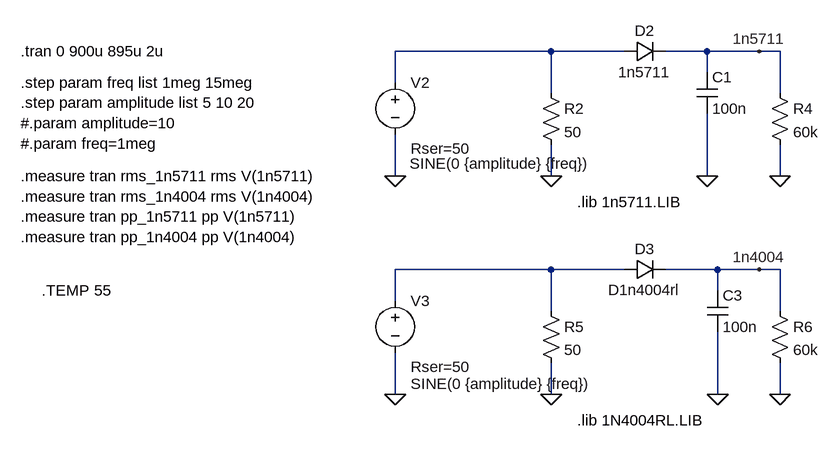
[diagram p0: schematic diode-capacitor-peak-detector.asc]
diode-capacitor-peak-detector.asc, the LTspice schematic file:
Version 4
SHEET 1 1252 992
WIRE 624 288 384 288
WIRE 736 288 624 288
WIRE 864 288 800 288
WIRE 944 288 864 288
WIRE 976 288 944 288
WIRE 864 320 864 288
WIRE 384 336 384 288
WIRE 624 352 624 288
WIRE 976 352 976 288
WIRE 384 480 384 416
WIRE 624 480 624 432
WIRE 864 480 864 384
WIRE 976 480 976 432
WIRE 624 624 384 624
WIRE 736 624 624 624
WIRE 880 624 800 624
WIRE 944 624 880 624
WIRE 976 624 944 624
WIRE 880 656 880 624
WIRE 384 672 384 624
WIRE 624 688 624 624
WIRE 976 688 976 624
WIRE 384 816 384 752
WIRE 624 816 624 768
WIRE 880 816 880 720
WIRE 976 816 976 768
FLAG 384 480 0
FLAG 944 288 1n5711
FLAG 624 480 0
FLAG 976 480 0
FLAG 384 816 0
FLAG 880 816 0
FLAG 944 624 1n4004
FLAG 624 816 0
FLAG 976 816 0
FLAG 864 480 0
SYMBOL voltage 384 320 R0
WINDOW 3 22 141 Left 2
WINDOW 39 24 118 Left 2
SYMATTR Value SINE(0 {amplitude} {freq})
SYMATTR SpiceLine Rser=50
SYMATTR InstName V2
SYMBOL diode 736 304 R270
WINDOW 0 32 32 VTop 2
WINDOW 3 0 32 VBottom 2
SYMATTR InstName D2
SYMATTR Value 1n5711
SYMBOL res 608 336 R0
SYMATTR InstName R2
SYMATTR Value 50
SYMBOL res 960 336 R0
SYMATTR InstName R4
SYMATTR Value 60k
SYMBOL voltage 384 656 R0
WINDOW 3 24 144 Left 2
WINDOW 39 24 118 Left 2
SYMATTR Value SINE(0 {amplitude} {freq})
SYMATTR SpiceLine Rser=50
SYMATTR InstName V3
SYMBOL diode 736 640 R270
WINDOW 0 32 32 VTop 2
WINDOW 3 0 32 VBottom 2
SYMATTR InstName D3
SYMATTR Value D1n4004rl
SYMBOL cap 864 656 R0
SYMATTR Value 100n
SYMATTR InstName C3
SYMATTR SpiceLine Rser=160.1m Lser=519.971p mfg="Würth Elektronik" pn="885012008039 WCAP-CSGP 1206" type="NP0"
SYMBOL res 608 672 R0
SYMATTR InstName R5
SYMATTR Value 50
SYMBOL res 960 672 R0
SYMATTR InstName R6
SYMATTR Value 60k
SYMBOL cap 848 320 R0
SYMATTR Value 100n
SYMATTR InstName C1
SYMATTR SpiceLine Rser=160.1m Lser=519.971p mfg="Würth Elektronik" pn="885012008039 WCAP-CSGP 1206" type="NP0"
TEXT -192 288 Left 2 !.tran 0 900u 895u 2u
TEXT 664 856 Left 2 !.lib 1N4004RL.LIB
TEXT -192 336 Left 2 !.step param freq list 1meg 15meg\n.step param amplitude list 5 10 20\n#.param amplitude=10\n#.param freq=1meg
TEXT 664 520 Left 2 !.lib 1n5711.LIB
TEXT -192 480 Left 2 !.measure tran rms_1n5711 rms V(1n5711)\n.measure tran rms_1n4004 rms V(1n4004)\n.measure tran pp_1n5711 pp V(1n5711)\n.measure tran pp_1n4004 pp V(1n4004)
TEXT -160 656 Left 2 !.TEMP 55

The netlist it stands for:
* diode-capacitor-peak-detector.asc
V2 N001 0 SINE(0 {amplitude} {freq}) Rser=50
D2 N001 1n5711 1n5711
R2 N001 0 50
R4 1n5711 0 60k
V3 N002 0 SINE(0 {amplitude} {freq}) Rser=50
D3 N002 1n4004 D1n4004rl
C3 1n4004 0 100n Rser=160.1m Lser=519.971p mfg="Würth Elektronik" pn="885012008039 WCAP-CSGP 1206" type="NP0"
R5 N002 0 50
R6 1n4004 0 60k
C1 1n5711 0 100n Rser=160.1m Lser=519.971p mfg="Würth Elektronik" pn="885012008039 WCAP-CSGP 1206" type="NP0"
.model D D
.lib standard.dio
.tran 0 900u 895u 2u
.lib 1N4004RL.LIB
.step param freq list 1meg 15meg
.step param amplitude list 5 10 20
#.param amplitude=10
#.param freq=1meg
.lib 1n5711.LIB
.measure tran rms_1n5711 rms V(1n5711)
.measure tran rms_1n4004 rms V(1n4004)
.measure tran pp_1n5711 pp V(1n5711)
.measure tran pp_1n4004 pp V(1n4004)
.TEMP 55
.backanno
.end